# Altium schematic sheet Power.SchDoc
size 292 x 193 mm; Author: Power Lin; DocumentNumber: 4; SheetNumber: 4; SheetTotal: 4; Website: wiki-power.com
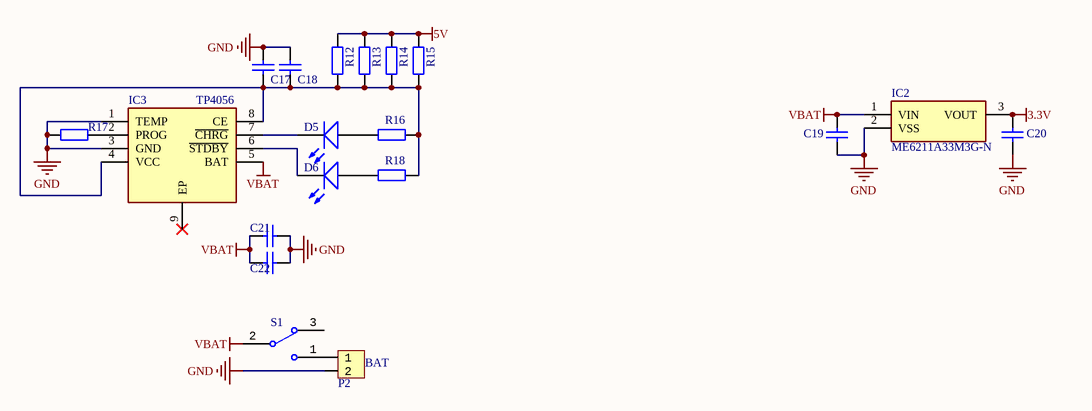
[diagram p0: Power.SchDoc]

## Parts
C17  10nF  [CAP-0603]  (value not drawn)
C18  100nF  [CAP-0603]  (value not drawn)
C19  1uF  [CAP-0603]  (value not drawn)
C20  1uF  [CAP-0603]  (value not drawn)
C21  100nF  [CAP-0603]  (value not drawn)
C22  10nF  [CAP-0603]  (value not drawn)
D5  RED  [LED-0603]  (value not drawn)
D6  RED  [LED-0603]  (value not drawn)
IC2  ME6211A33M3G-N  [SOT-23-3]
IC3  TP4056  [MSOP_E120_P0.5_10]
P2  HDR1x2_2.54  [HDR1X2_2.54_90]  (value not drawn)
R12  1R  [R-0603]  (value not drawn)
R13  1R  [R-0603]  (value not drawn)
R14  1R  [R-0603]  (value not drawn)
R15  1R  [R-0603]  (value not drawn)
R16  2K  [R-0603]  (value not drawn)
R17  1.2K  [R-0603]  (value not drawn)
R18  10K  [R-0603]  (value not drawn)
S1  Switch_SPDT  [SwitchSPDT_2.8X6.6_90]  (value not drawn)

## Nets
3.3V: C20.2 IC2.3(VOUT)
5V: R12.2 R13.2 R14.2 R15.2
GND: C17.2 C18.2 C19.1 C20.1 C21.1 C22.1 IC2.2(VSS) IC3.1(TEMP) IC3.3(GND) P2.2 R17.1
VBAT: C19.2 C21.2 C22.2 IC2.1(VIN) IC3.5(BAT) S1.2
NetC17_1: C17.1 C18.1 IC3.4(VCC) IC3.8(CE) R12.1 R13.1 R14.1 R15.1 R16.2 R18.2
NetD5_A: D5.A R16.1
NetD5_K: D5.K IC3.7(~{CHRG})
NetD6_A: D6.A R18.1
NetD6_K: D6.K IC3.6(~{STDBY})
NetIC3_2: IC3.2(PROG) R17.2
NetP2_1: P2.1 S1.1

Not connected (* = marked no-connect by the designer): IC3 9(EP)*; S1 3

## Notes on the sheet
- (near P2) BAT
- Author
- DocumentName
- ModifiedDate
- ProjectName
- SheetNumber
- SheetTotal
- Website
- Revision

## Library data of the parts
C17-C22 = CAP: 贴片电容; ComponentLink1Description: 供应商链接; ComponentLink1URL: http://www.szlcsc.com/product/details_53938.html; Package: 0402; Supplier: LC; SuppliersPartNumber: C52923
D5 D6 = LED: 发光二极管; pin to pad: A>1 K>2; ComponentLink1Description: 供应商链接; ComponentLink1URL: http://www.szlcsc.com/product/details_2663.html; Package: 0603; Supplier: LC; SuppliersPartNumber: C2290
IC2 = ME6211A33M3G-N: 线性稳压; Manufacturer_Name: Nexperia; Manufacturer_Part_Number: SI2302DS; Datasheet Link: https://assets.nexperia.com/documents/data-sheet/SI2302DS.pdf; Height: 1.1mm; Mouser Part Number: N/A; Mouser Price/Stock: https://www.mouser.com/Search/Refine.aspx?Keyword=N%2FA; RS Part Number: 7983053P; RS Price/Stock: http://uk.rs-online.com/web/p/products/7983053P
IC3 = TP4056: 锂电池充电（1A 线性）; Manufacturer_Name: Nanjing Extension Microelectronics; Manufacturer_Part_Number: TP4056-42-ESOP8; Datasheet Link: https://datasheet.lcsc.com/szlcsc/1906261508_Nanjing-Extension-Microelectronics-TP4056-42-ESOP8_C16581.pdf; Height: 1.75mm
P2 = HDR1x2_2.54: Header
R12-R18 = RES: 贴片电阻; Package: 0805; Supplier: LC; SuppliersPartNumber: C17798
S1 = Switch_SPDT: Value: SPDT 3P; Type: SPDT